# Altium schematic sheet top.SchDoc
size A
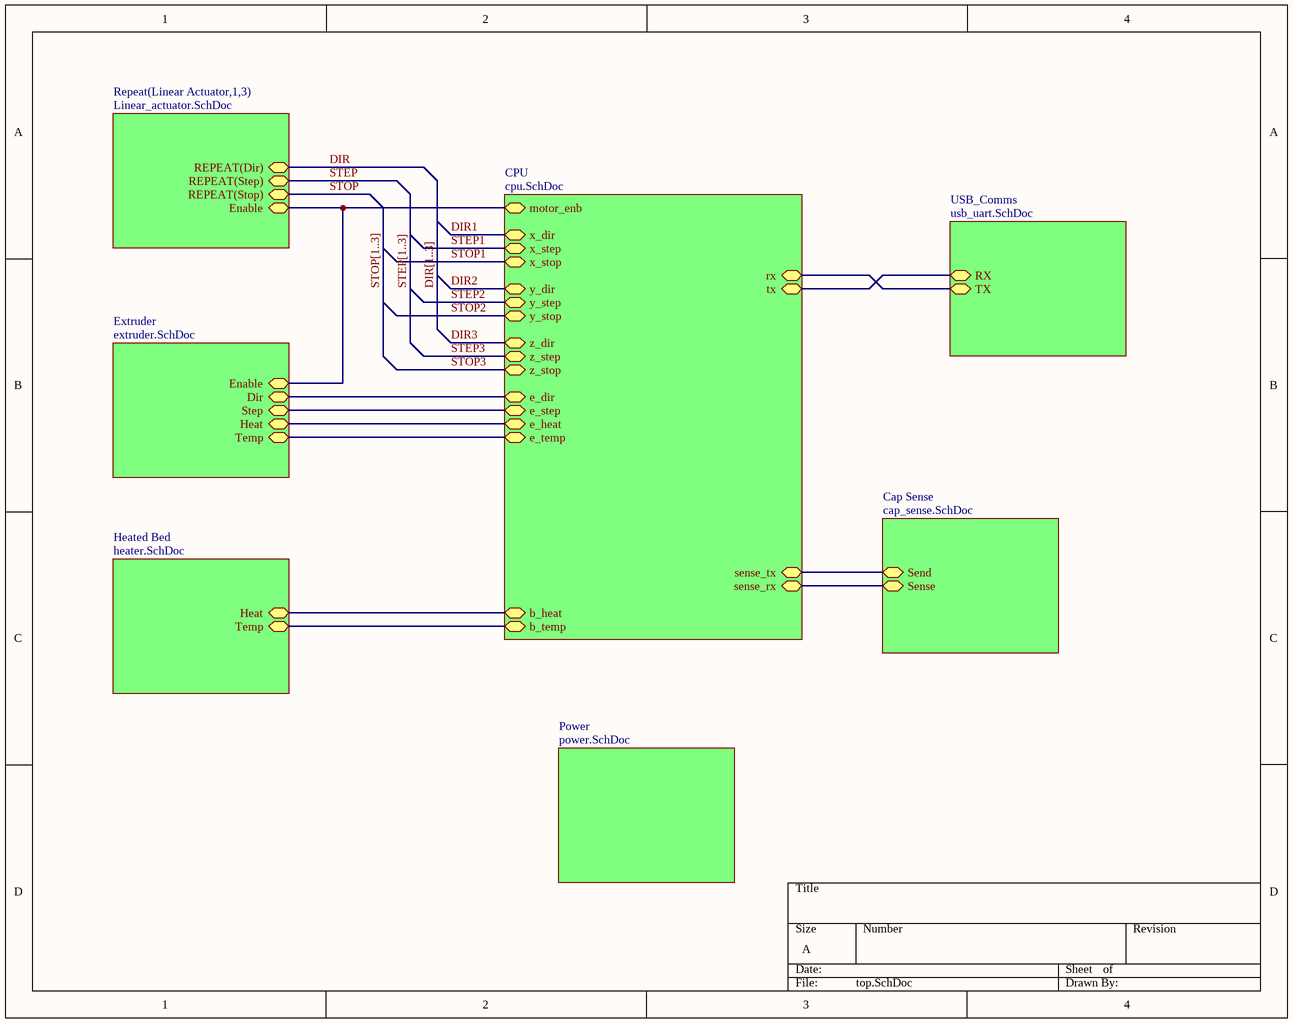
[diagram p0: top.SchDoc]

## Sub-sheets
Cap Sense = cap_sense.SchDoc: Sense, Send
CPU = cpu.SchDoc: x_step, x_dir, motor_enb, y_step, y_dir, z_step, z_dir, e_step, e_dir, e_heat, e_temp, b_heat, b_temp, x_stop, y_stop, z_stop, rx, tx, sense_rx, sense_tx
Extruder = extruder.SchDoc: Dir, Step, Enable, Heat, Temp
Heated Bed = heater.SchDoc: Temp, Heat
Power = power.SchDoc: no entries
Repeat(Linear Actuator,1,3) = Linear_actuator.SchDoc: REPEAT(Dir), REPEAT(Step), Enable, REPEAT(Stop)
USB_Comms = usb_uart.SchDoc: RX, TX

## Nets
DIR: sheet Repeat(Linear Actuator,1,3)/REPEAT(Dir)
DIR1: sheet CPU/x_dir
DIR2: sheet CPU/y_dir
DIR3: sheet CPU/z_dir
STEP: sheet Repeat(Linear Actuator,1,3)/REPEAT(Step)
STEP1: sheet CPU/x_step
STEP2: sheet CPU/y_step
STEP3: sheet CPU/z_step
STOP: sheet Repeat(Linear Actuator,1,3)/REPEAT(Stop)
STOP1: sheet CPU/x_stop
STOP2: sheet CPU/y_stop
STOP3: sheet CPU/z_stop
(unnamed): sheet CPU/motor_enb, sheet Repeat(Linear Actuator,1,3)/Enable, sheet Extruder/Enable
(unnamed): sheet CPU/e_step, sheet Extruder/Step
(unnamed): sheet CPU/e_dir, sheet Extruder/Dir
(unnamed): sheet CPU/e_heat, sheet Extruder/Heat
(unnamed): sheet CPU/e_temp, sheet Extruder/Temp
(unnamed): sheet CPU/b_heat, sheet Heated Bed/Heat
(unnamed): sheet CPU/b_temp, sheet Heated Bed/Temp
(unnamed): sheet CPU/rx, sheet USB_Comms/TX
(unnamed): sheet CPU/tx, sheet USB_Comms/RX
(unnamed): sheet CPU/sense_rx, sheet Cap Sense/Sense
(unnamed): sheet CPU/sense_tx, sheet Cap Sense/Send

## Buses and harness runs
bus DIR[1..3]
bus STEP[1..3]
bus STOP[1..3]